# EAGLE design Board (EAGLE 9.5.2)

## Sheet 1 of 3
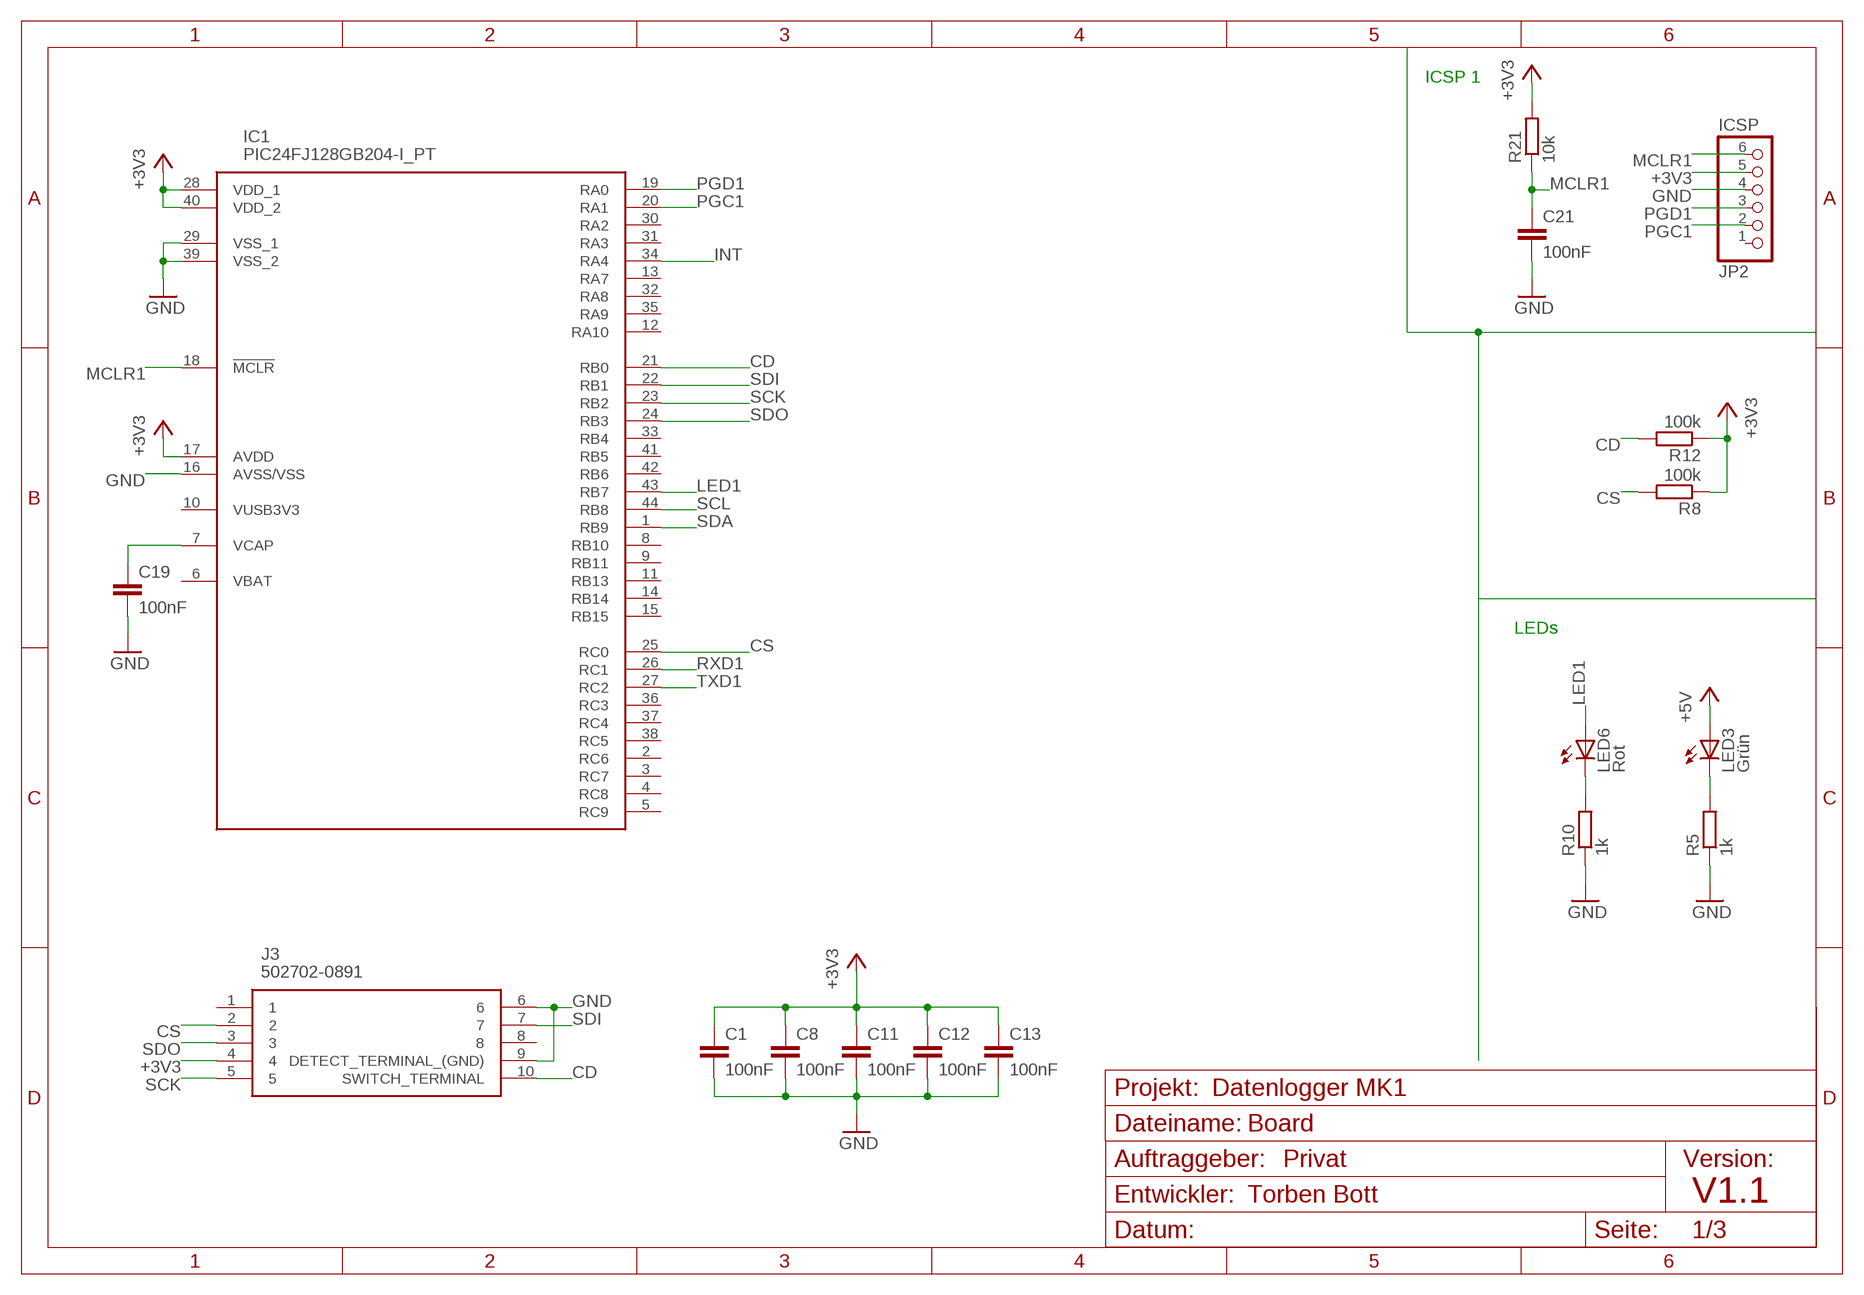
[diagram p0: schematic, sheet 1]

### Parts
C1  100nF  C-EUC0805  [C0805]
C8  100nF  C-EUC0805  [C0805]
C11  100nF  C-EUC0805  [C0805]
C12  100nF  C-EUC0805  [C0805]
C13  100nF  C-EUC0805  [C0805]
C19  100nF  C-EUC0805  [C0805]
C21  100nF  C-EUC0805  [C0805]
IC1  PIC24FJ128GB204-I_PT  [QFP80P1200X1200X120-44N]
J3  502702-0891  [502702-0891]
JP2  ICSP  PINHD-1X6/90  [1X06/90]
LED3  Grün  LEDCHIPLED_0805  [CHIPLED_0805]
LED6  Rot  LEDCHIPLED_0805  [CHIPLED_0805]
R5  1k  R-EU_R0805  [R0805]
R8  100k  R-EU_R0805  [R0805]
R10  1k  R-EU_R0805  [R0805]
R12  100k  R-EU_R0805  [R0805]
R21  10k  R-EU_R0805  [R0805]

### Nets
+3V3: C1.1 C8.1 C11.1 C12.1 C13.1 IC1.17(AVDD) IC1.28(VDD_1) IC1.40(VDD_2) J3.4 JP2.5 R8.1 R12.1 R21.2 ; also sheet 2,3
+5V: LED3.A ; also sheet 3
CD: IC1.21(RB0) J3.10(SWITCH_TERMINAL) R12.2
CS: IC1.25(RC0) J3.2 R8.2
GND: C1.2 C8.2 C11.2 C12.2 C13.2 C19.2 C21.2 IC1.16(AVSS/VSS) IC1.29(VSS_1) IC1.39(VSS_2) J3.6 J3.9(DETECT_TERMINAL_(GND)) JP2.4 R5.1 R10.1 ; also sheet 2,3
INT: IC1.34(RA4) ; also sheet 2
LED1: IC1.43(RB7) LED6.A
MCLR1: C21.1 IC1.18(!MCLR) JP2.6 R21.1
N$8: LED3.C R5.2
N$16: LED6.C R10.2
N$20: C19.1 IC1.7(VCAP)
PGC1: IC1.20(RA1) JP2.2
PGD1: IC1.19(RA0) JP2.3
RXD1: IC1.26(RC1)
SCK: IC1.23(RB2) J3.5
SCL: IC1.44(RB8) ; also sheet 2
SDA: IC1.1(RB9) ; also sheet 2
SDI: IC1.22(RB1) J3.7
SDO: IC1.24(RB3) J3.3
TXD1: IC1.27(RC2)
Unconnected: IC1.2(RC6) IC1.3(RC7) IC1.4(RC8) IC1.5(RC9) IC1.6(VBAT) IC1.8(RB10) IC1.9(RB11) IC1.10(VUSB3V3) IC1.11(RB13) IC1.12(RA10) IC1.13(RA7) IC1.14(RB14) IC1.15(RB15) IC1.30(RA2) IC1.31(RA3) IC1.32(RA8) IC1.33(RB4) IC1.35(RA9) IC1.36(RC3) IC1.37(RC4) IC1.38(RC5) IC1.41(RB5) IC1.42(RB6) J3.1 J3.8 JP2.1

### Notes on the sheet
- ICSP 1
- LEDs
- Datenlogger MK1
- Privat
- Torben Bott | V1.1

## Sheet 2 of 3
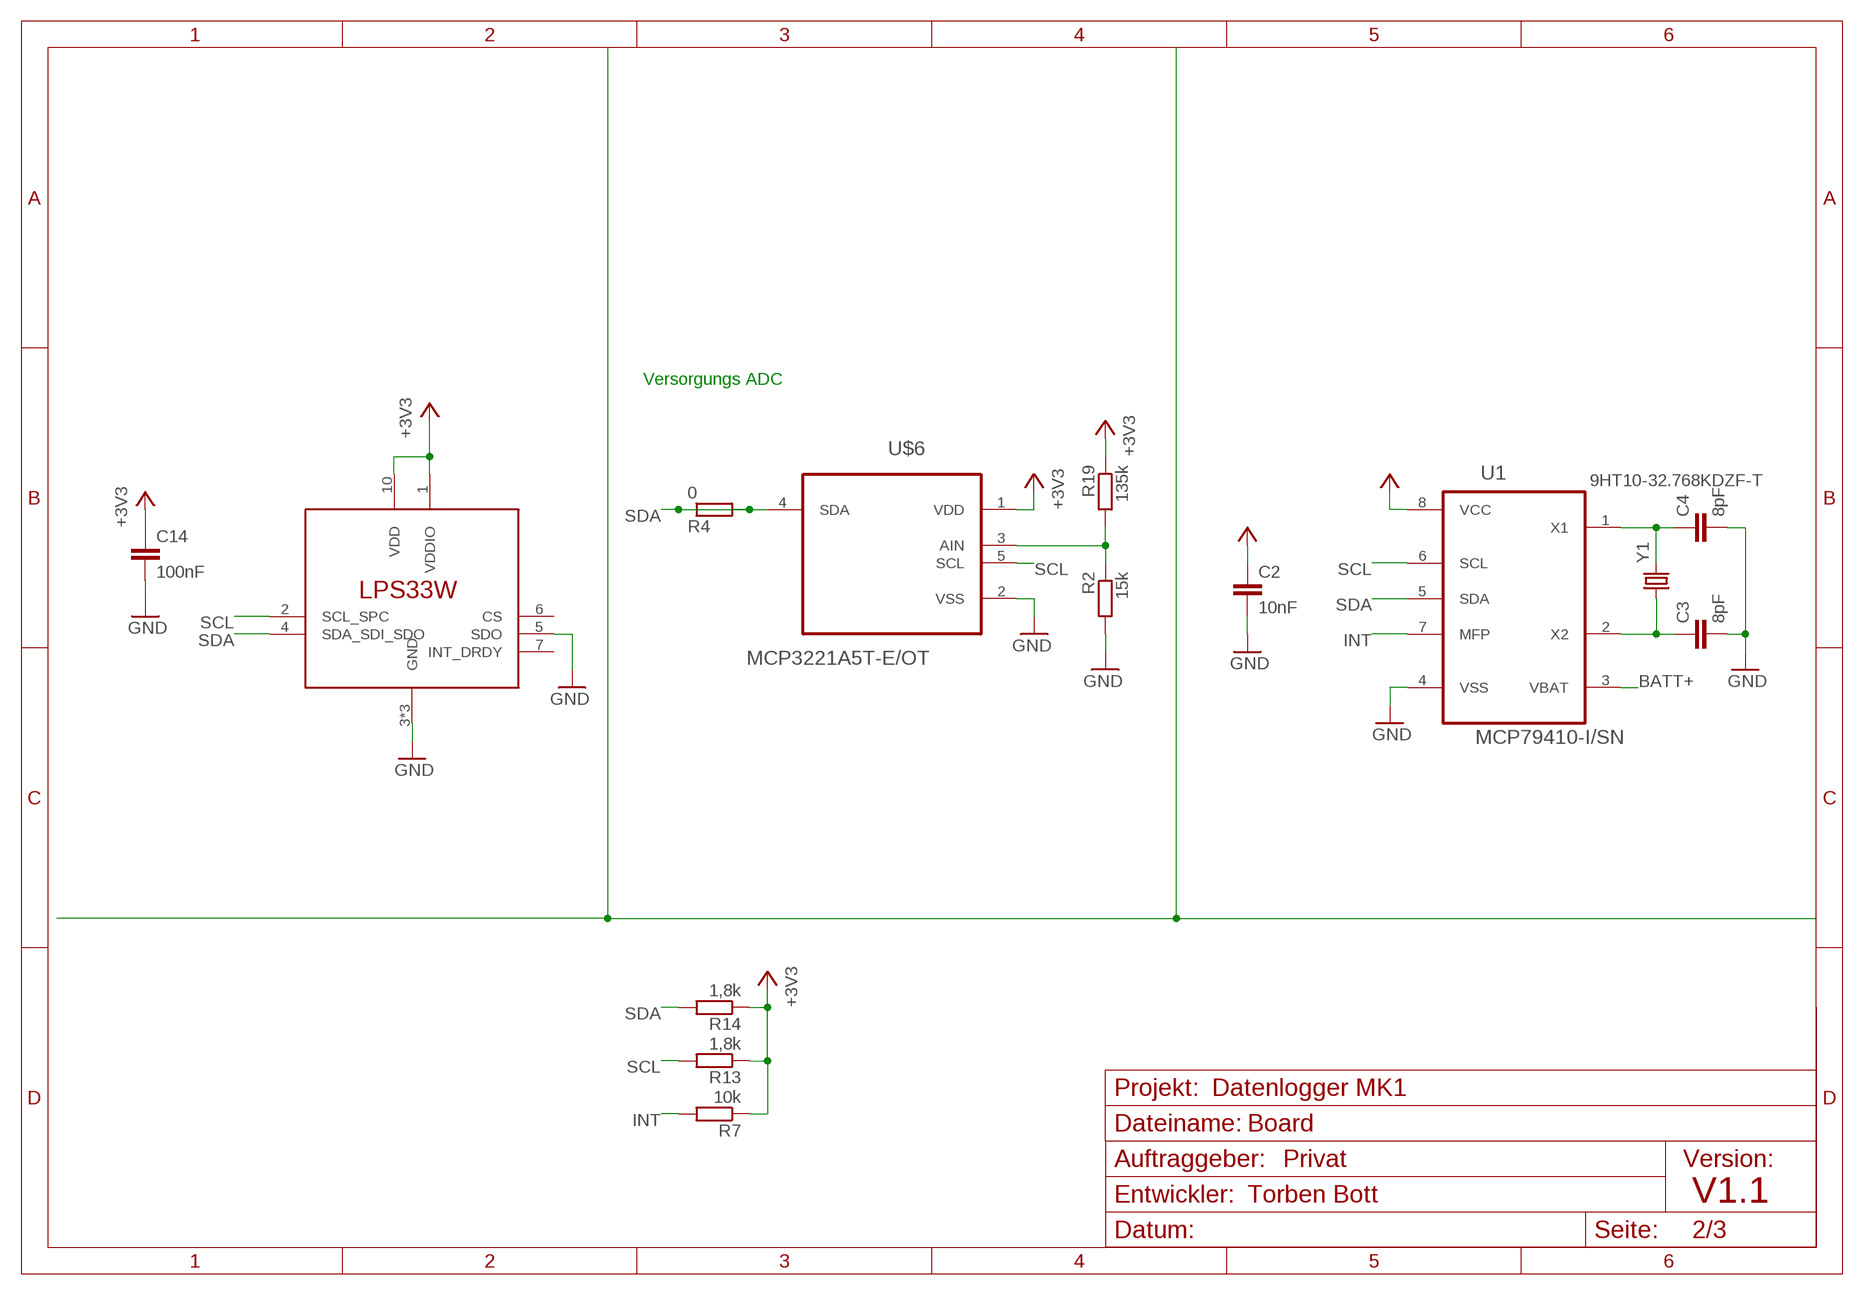
[diagram p1: schematic, sheet 2]

### Parts
C2  10nF  C-EUC0805  [C0805]
C3  8pF  C-EUC0805  [C0805]
C4  8pF  C-EUC0805  [C0805]
C14  100nF  C-EUC0805  [C0805]
R2  15k  R-EU_R0805  [R0805]
R4  0  R-EU_R0805  [R0805]
R7  10k  R-EU_R0805  [R0805]
R13  1,8k  R-EU_R0805  [R0805]
R14  1,8k  R-EU_R0805  [R0805]
R19  135k  R-EU_R0805  [R0805]
U1  MCP79410-I/SN  [SOIC127P600X175-8N]
U$6  MCP3221A5T-E/OT  [SOT95P270X145-5N]
U$7  LPS33W  [CCLGA10L]
Y1  9HT10-32.768KDZF-T  [9HT1032768KEZFT]

### Nets
+3V3: C2.1 C14.1 R7.1 R13.1 R14.1 R19.1 U1.8(VCC) U$6.1(VDD) U$7.1(VDDIO) U$7.10(VDD) ; also sheet 1,3
BATT+: U1.3(VBAT) ; also sheet 3
GND: C2.2 C3.2 C4.2 C14.2 R2.2 U1.4(VSS) U$6.2(VSS) U$7.3(GND) U$7.5(SDO) U$7.8(GND) U$7.9(GND) ; also sheet 1,3
INT: R7.2 U1.7(MFP) ; also sheet 1
N$11: C3.1 U1.2(X2) Y1.1
N$13: C4.1 U1.1(X1) Y1.2
N$21: R2.1 R19.2 U$6.3(AIN)
SCL: R13.2 U1.6(SCL) U$6.5(SCL) U$7.2(SCL_SPC) ; also sheet 1
SDA: R4.1 R4.2 R14.2 U1.5(SDA) U$6.4(SDA) U$7.4(SDA_SDI_SDO) ; also sheet 1
Unconnected: U$7.6(CS) U$7.7(INT_DRDY)

### Notes on the sheet
- Versorgungs ADC
- Datenlogger MK1
- Privat
- Torben Bott | V1.1

## Sheet 3 of 3
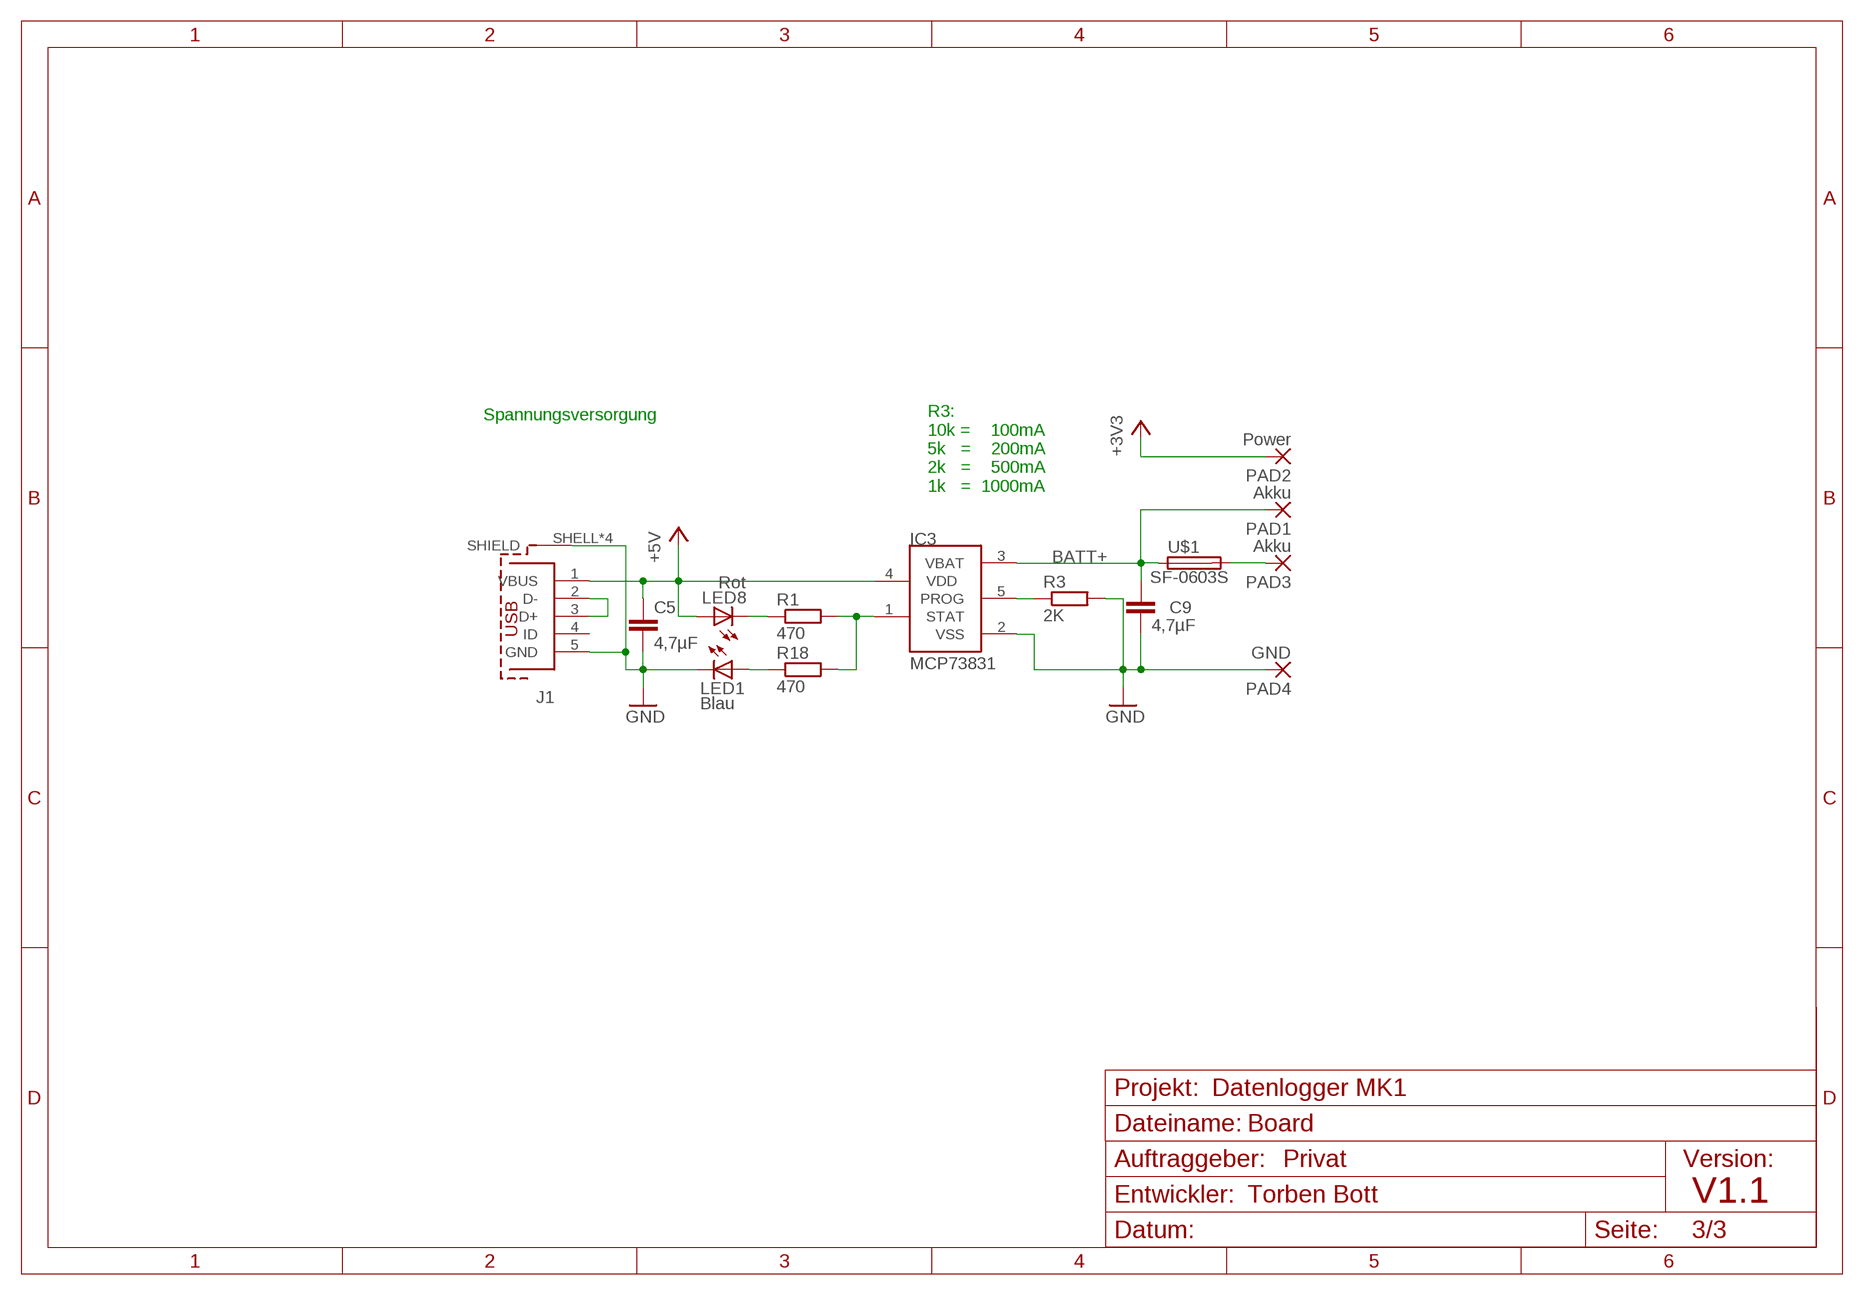
[diagram p2: schematic, sheet 3]

### Parts
C5  4,7µF  C-EUC0805  [C0805]
C9  4,7µF  C-EUC0805  [C0805]
IC3  MCP73831  [SOT23-5L]
J1  629105136821  [629105136821]
LED1  Blau  LEDCHIPLED_0805  [CHIPLED_0805]
LED8  Rot  LEDCHIPLED_0805  [CHIPLED_0805]
PAD1  Akku  WIREPADSMD5-1,8  [5-1,8]
PAD2  Power  WIREPADSMD5-1,8  [5-1,8]
PAD3  Akku  WIREPADSMD5-1,8  [5-1,8]
PAD4  GND  WIREPADSMD5-1,8  [5-1,8]
R1  470  R-EU_R0805  [R0805]
R3  2K  R-EU_R0805  [R0805]
R18  470  R-EU_R0805  [R0805]
U$1  SF-0603S  [R0603]

### Nets
+3V3: PAD2.1(P) ; also sheet 1,2
+5V: C5.1 IC3.4(VDD) J1.1(VBUS) LED8.A ; also sheet 1
BATT+: C9.1 IC3.3(VBAT) PAD1.1(P) U$1.1 ; also sheet 2
GND: C5.2 C9.2 IC3.2(VSS) J1.5(GND) J1.SHELL1(SHIELD) J1.SHELL2(SHIELD) J1.SHELL3(SHIELD) J1.SHELL(SHIELD) LED1.C PAD4.1(P) R3.2 ; also sheet 1,2
N$3: LED8.C R1.1
N$5: IC3.5(PROG) R3.1
N$6: PAD3.1(P) U$1.2
N$7: LED1.A R18.1
N$23: IC3.1(STAT) R1.2 R18.2
N$27: J1.2(D-) J1.3(D+)
Unconnected: J1.4(ID)

### Notes on the sheet
- Spannungsversorgung
- R3:
  10k =    100mA
  5k   =    200mA
  2k   =    500mA
  1k   =  1000mA
- Datenlogger MK1
- Privat
- Torben Bott | V1.1

## Library data of the parts
C1-C4 C8 C11-C14 C19 C21 = rcl:C-EU: CAPACITOR, European symbol; SPICEPREFIX: C
C5 C9 = rcl:C-EU: CAPACITOR, European symbol
IC1 = PIC24FJ128GB204-I_PT:PIC24FJ128GB204-I_PT: PIC24FJ128GB204-I/PT 16bit PIC Microcontroller, 32MHz, 128 kB Flash, 8 kB RAM, 44-Pin TQFP Source: Datasheet <https://componentsearchengine.com/Datasheets/1/PIC24FJ128GB204-I_PT.pdf>; DESCRIPTION: PIC24FJ128GB204-I/PT 16bit PIC Microcontroller, 32MHz, 128 kB Flash, 8 kB RAM, 44-Pin TQFP; HEIGHT: 1.2mm; MANUFACTURER_NAME: Microchip; MANUFACTURER_PART_NUMBER: PIC24FJ128GB204-I/PT; MOUSER_PART_NUMBER: 579-P24FJ128GB204IPT; MOUSER_PRICE-STOCK: https://www.mouser.com/Search/Refine.aspx?Keyword=579-P24FJ128GB204IPT
IC3 = microchip-update-2:MCP73831: Miniature Single-Cell, Fully Integrated Li-Ion, Li-Polymer Charge Management Controllers
J1 = InputOutputIO (rev18a):629105136821: WR-COM SMT Horizontal 5 Contacts Micro USB Type B,5 pins=>Code : Con_I-O_COM_MicroUSB_629105136821 <http://katalog.we-online.de/media/images/eican/Con_I-O_COM_MicroUSB_629105136821_pf2.jpg> Details see: http://katalog.we-online.de/en/em/COM_MICRO_SMT_TYPE_B_HORIZONTAL/629105136821?m Created 2014-07-09, Karrer Zheng 2014 (C) Würth Elektronik
J3 = 502702-0891:502702-0891: MOLEX - 502702-0891 - MEMORY CARD CONNECTOR, MICROSD, 8 POSITION Source: Datasheet <https://componentsearchengine.com/Datasheets/1/502702-0891.pdf>; DESCRIPTION: MOLEX - 502702-0891 - MEMORY CARD CONNECTOR, MICROSD, 8 POSITION; HEIGHT: mm; MANUFACTURER_NAME: Molex; MANUFACTURER_PART_NUMBER: 502702-0891; MOUSER_PART_NUMBER: 538-502702-0891; MOUSER_PRICE-STOCK: https://www.mouser.com/Search/Refine.aspx?Keyword=538-502702-0891
JP2 = pinhead:PINHD-1X6: PIN HEADER
LED1 LED3 LED6 LED8 = led:LED: LED OSRAM: - CHIPLED LG R971, LG N971, LY N971, LG Q971, LY Q971, LO R971, LY R971 LH N974, LH R974 LS Q976, LO Q976, LY Q976 LO Q996 - Hyper CHIPLED LW Q18S LB Q993, LB Q99A, LB R99A - SideLED LS A670, LO A670, LY A670, LG A670, LP A670 LB A673, LV A673, LT A673, LW A673 LH A674 LY A675 LS A676, LA A676, LO A676, LY A676, LW A676 LS A679, LY A679, LG A679 - Hyper Micro SIDELED® LS Y876, LA Y876, LO Y876, LY Y876 LT Y87S - SmartLED LW L88C, LW L88S LB L89C, LB L89S, LG L890 LS L89K, LO L89K, LY L89K LS L896, LA L896, LO L896, LY L896 - TOPLED LS T670, LO T670, LY T670, LG T670, LP T670 LSG T670, LSP T670, LSY T670, LOP T670, LYG T670 LG T671, LOG T671, LSG T671 LB T673, LV T673, LT T673, LW T673 LH T674 LS T676, LA T676, LO T676, LY T676, LB T676, LH T676, LSB T676, LW T676 LB T67C, LV T67C, LT T67C, LS T67K, LO T67K, LY T67K, LW E67C LS E67B, LA E67B, LO E67B, LY E67B, LB E67C, LV E67C, LT E67C LW T67C LS T679, LY T679, LG T679 LS T770, LO T770, LY T770, LG T770, LP T770 LB T773, LV T773, LT T773, LW T773 LH T774 LS E675, LA E675, LY E675, LS T675 LS T776, LA T776, LO T776, LY T776, LB T776 LHGB T686 LT T68C, LB T68C - Hyper Mini TOPLED® LB M676 - Mini TOPLED Santana® LG M470 LS M47K, LO M47K, LY M47K Source: http://www.osram.convergy.de LUXEON: - LUMILED® LXK2-PW12-R00, LXK2-PW12-S00, LXK2-PW14-U00, LXK2-PW14-V00 LXK2-PM12-R00, LXK2-PM12-S00, LXK2-PM14-U00 LXK2-PE12-Q00, LXK2-PE12-R00, LXK2-PE12-S00, LXK2-PE14-T00, LXK2-PE14-U00 LXK2-PB12-K00, LXK2-PB12-L00, LXK2-PB12-M00, LXK2-PB14-N00, LXK2-PB14-P00, LXK2-PB14-Q00 LXK2-PR12-L00, LXK2-PR12-M00, LXK2-PR14-Q00, LXK2-PR14-R00 LXK2-PD12-Q00, LXK2-PD12-R00, LXK2-PD12-S00 LXK2-PH12-R00, LXK2-PH12-S00 LXK2-PL12-P00, LXK2-PL12-Q00, LXK2-PL12-R00 Source: www.luxeon.com KINGBRIGHT: KA-3528ASYC Source: www.kingbright.com
PAD1-PAD4 = wirepad:WIREPAD: Wire PAD connect wire on PCB
R1 R3 R18 = rcl:R-EU_: RESISTOR, European symbol
R2 R4 R5 R7 R8 R10 R12-R14 R19 R21 = rcl:R-EU_: RESISTOR, European symbol; SPICEPREFIX: R
U1 = Microchip-MCP79410-I_SN:MCP79410-I/SN: I2C™ Real-Time Clock/Calendar with EEPROM, SRAM,SOIC-8; MPN: MCP79410-I/SN; OC_FARNELL: 1823155; OC_NEWARK: 76R6660; PACKAGE: SOIC-8; SUPPLIER: MICROCHIP
U$1 = Eigene Library:SF-0603S; FARNELL: 1652144
U$6 = Eigene Library:MCP3221A5T-E/OT: A/D Converter; MPN: MCP3221A5T-E/OT; OC_FARNELL: 1332098; OC_NEWARK: 34M7446; PACKAGE: SOT-5; SUPPLIER: Microchip
U$7 = microbuilder:LPS33W
Y1 = 9HT10-32.768KDZF-T:9HT10-32.768KDZF-T: TXC 32.768kHz Crystal +/-20ppm SMD 2-Pin 3.2 x 1.5 x 0.75mm Source: Datasheet <https://componentsearchengine.com/Datasheets/1/9HT10-32.768KDZF-T.pdf>; DESCRIPTION: TXC 32.768kHz Crystal +/-20ppm SMD 2-Pin 3.2 x 1.5 x 0.75mm; HEIGHT: 0.85mm; MANUFACTURER_NAME: TXC; MANUFACTURER_PART_NUMBER: 9HT10-32.768KDZF-T; MOUSER_PART_NUMBER: 717-9HT10-32.768KDZF; MOUSER_PRICE-STOCK: https://www.mouser.com/Search/Refine.aspx?Keyword=717-9HT10-32.768KDZF

## Board
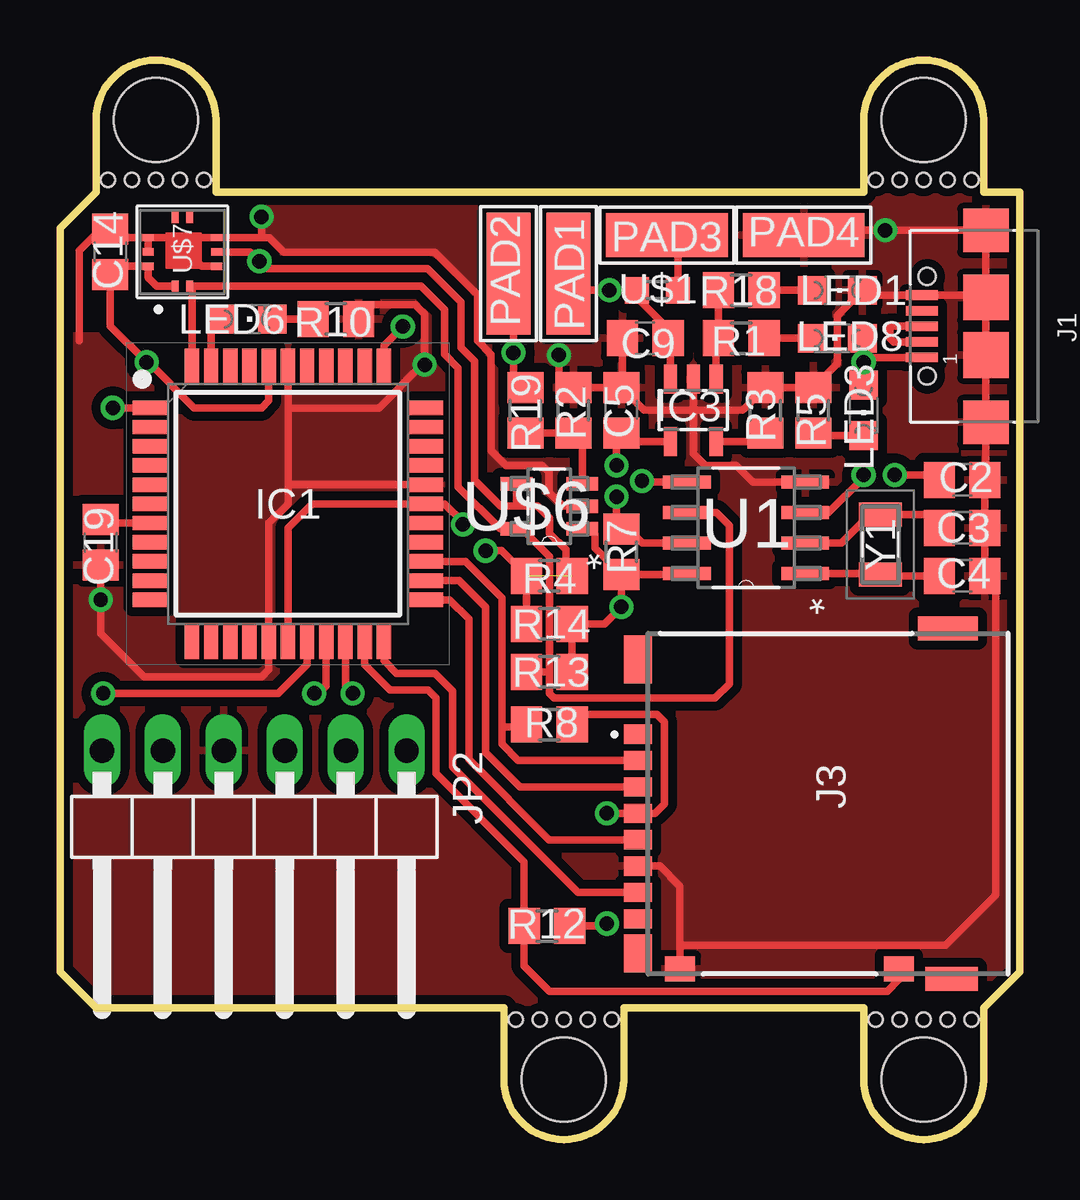
[diagram p3: board, top side]
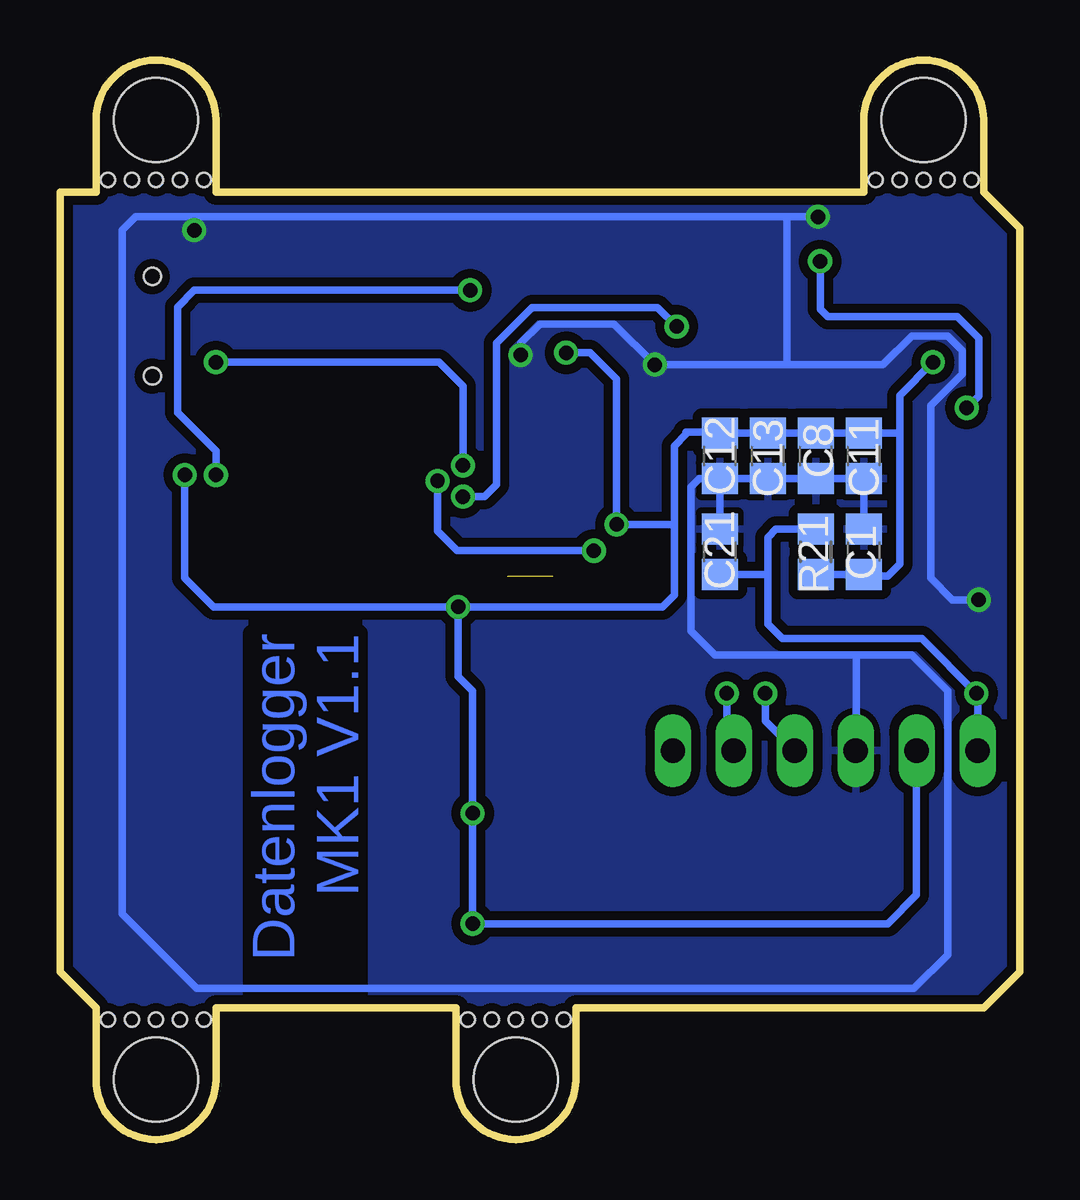
[diagram p4: board, bottom side, seen from below]

Size 40 x 45 mm. Coordinates in mm from the lower left corner, seen from the top.
Outline: 40,7 40,39.5 38.5,39.5 38.5,42.5 arc90 36,45 arc90 33.5,42.5 33.5,39.5 6.5,39.5 6.5,42.5 arc90 4,45 arc90 1.5,42.5 1.5,39.5 0,38 0,7 1.5,5.5 18.5,5.5 18.5,2.5 arc90 21,0 arc90 23.5,2.5 23.5,5.5 33.5,5.5 33.5,2.5 arc90 36,0 arc90 38.5,2.5 38.5,5.5 40,7
Copper layers (1*16): Top 0.035mm / dielectric 1.5mm / Bottom 0.035mm
Design rules "Torben": minimum track width 12mil, minimum drill 0.6mm, track to track 15mil, track to pad 8mil, pad to pad 6mil, via to via 6mil, smd to smd 6mil, copper to edge 15mil, drill to drill 6mil, minimum pad ring 10mil, minimum via ring 8mil, stop-mask expansion 4mil, vias tented up to drill 0mil, thermal gap 10mil
Holes 3.5 mm at 36,2.5 36,42.5 4,42.5 21,2.5
Holes 0.6 mm at 38,5 37,5 36,5 35,5 34,5 34,40 35,40 36,40 37,40 38,40 2,40 3,40 4,40 5,40 6,40 23,5 22,5 21,5 20,5 19,5

### Footprints (pad centres in the part's own frame; a part is rotated, then mirrored left to right if it is on the bottom)
C0805 = smd 1.3 x 1.5: 1 -0.95,0; 2 0.95,0
QFP80P1200X1200X120-44N = smd 1.475 x 0.6: 1 -5.738,4; 2 -5.738,3.2; 3 -5.738,2.4; 4 -5.738,1.6; 5 -5.738,0.8; 6 -5.738,0; 7 -5.738,-0.8; 8 -5.738,-1.6; 9 -5.738,-2.4; 10 -5.738,-3.2; 11 -5.738,-4; 23 5.738,-4; 24 5.738,-3.2; 25 5.738,-2.4; 26 5.738,-1.6; 27 5.738,-0.8; 28 5.738,0; 29 5.738,0.8; 30 5.738,1.6; 31 5.738,2.4; 32 5.738,3.2; 33 5.738,4 | smd 0.6 x 1.475: 12 -4,-5.738; 13 -3.2,-5.738; 14 -2.4,-5.738; 15 -1.6,-5.738; 16 -0.8,-5.738; 17 0,-5.738; 18 0.8,-5.738; 19 1.6,-5.738; 20 2.4,-5.738; 21 3.2,-5.738; 22 4,-5.738; 34 4,5.738; 35 3.2,5.738; 36 2.4,5.738; 37 1.6,5.738; 38 0.8,5.738; 39 0,5.738; 40 -0.8,5.738; 41 -1.6,5.738; 42 -2.4,5.738; 43 -3.2,5.738; 44 -4,5.738
SOT23-5L = smd 0.55 x 1.2: 1 -0.95,-1.3; 2 0,-1.3; 3 0.95,-1.3; 4 0.95,1.3; 5 -0.95,1.3
629105136821 = smd 0.4 x 1.35: 1 -1.3,2.675; 2 -0.65,2.675; 3 0,2.675; 4 0.65,2.675; 5 1.3,2.675 | smd 1.8 x 1.9: SHELL -4,0; SHELL3 4,0 | smd 1.9 x 1.9: SHELL1 -1.2,0; SHELL2 1.2,0 | hole 0.7: -2.075,2.45; 2.075,2.45
502702-0891 = smd 0.8 x 1.16: 1 4.9,0; 2 6,0; 3 7.1,0; 4 8.2,0; 5 9.3,0; 6 10.4,0; 7 11.5,0; 8 12.6,0 | smd 1.05 x 1.25: 9 14.685,1.745; 10 14.685,10.87 | smd 1 x 2.2: 11 15.1,13.07 | smd 1 x 2.5: 12 0.5,12.92 | smd 2 x 1.16: 13 1.79,0 | smd 1.6 x 1.16: 14 14.04,0
1X06/90 = drill 1.016 long: 1 -6.35,-3.81; 2 -3.81,-3.81; 3 -1.27,-3.81; 4 1.27,-3.81; 5 3.81,-3.81; 6 6.35,-3.81
CHIPLED_0805 = smd 1.2 x 1.2: A 0,-1.05; C 0,1.05
5-1,8 = smd 1.829 x 5.08: 1 0,0
R0805 = smd 1.3 x 1.5: 1 -0.95,0; 2 0.95,0
SOIC127P600X175-8N = smd 1.981 x 0.559: 1 -2.464,1.905; 2 -2.464,0.635; 3 -2.464,-0.635; 4 -2.464,-1.905; 5 2.464,-1.905; 6 2.464,-0.635; 7 2.464,0.635; 8 2.464,1.905
R0603 = smd 1 x 1.1: 1 -0.85,0; 2 0.85,0
SOT95P270X145-5N = smd 1.321 x 0.559: 1 -1.372,0.94; 2 -1.372,0; 3 -1.372,-0.94; 4 1.372,-0.94; 5 1.372,0.94
CCLGA10L = smd 0.45 x 0.3: 1 -1.425,0.3; 2 -1.425,-0.3; 6 1.425,-0.3; 7 1.425,0.3 | smd 0.3 x 0.45: 3 -0.6,-1.425; 4 0,-1.425; 5 0.6,-1.425; 8 0.6,1.425; 9 0,1.425; 10 -0.6,1.425
9HT1032768KEZFT = smd 1 x 1.8: 1 -1.25,0; 2 1.25,0

### Placement (x,y rotation side)
C1  6.5,24.5 90 bottom
C2  37.6,27.5 0 top
C3  37.6,25.5 0 top
C4  37.6,23.5 0 top
C5  23.4,30.4 90 top
C8  8.5,28.5 270 bottom
C9  24.4,33.4 180 top
C11  6.5,28.5 270 bottom
C12  12.5,28.5 270 bottom
C13  10.5,28.5 270 bottom
C14  2.1,37 90 top
C19  1.7,24.9 270 top
C21  12.5,24.5 90 bottom
IC1  9.5,26.5 0 top
IC3  26.4,30.4 180 top
J1  38.6,33.9 90 top
J3  24.1,21.8 270 top
JP2  8.1,12.4 180 top
LED1  32.4,35.4 270 top
LED3  33.5,30.4 180 top
LED6  7.8,34.2 270 top
LED8  32.4,33.4 90 top
PAD1  21.2,36.1 180 top
PAD2  18.7,36.1 0 top
PAD3  25.3,37.7 90 top
PAD4  31,37.7 90 top
R1  28.4,33.4 180 top
R2  21.4,30.4 90 top
R3  29.4,30.4 90 top
R4  20.4,23.5 0 top
R5  31.4,30.4 270 top
R7  23.4,24.5 90 top
R8  20.4,17.3 180 top
R10  11.5,34.2 180 top
R12  20.3,8.9 180 top
R13  20.4,19.5 180 top
R14  20.4,21.5 180 top
R18  28.4,35.4 180 top
R19  19.4,30.4 270 top
R21  8.5,24.5 270 bottom
U1  28.6,25.5 180 top
U$1  24.9,35.4 0 top
U$6  20.4,26.4 180 top
U$7  5.1,37 90 top
Y1  34.2,24.8 270 top

### Tracks (layer width: path | path; a pad name or v marks a point on that pad's centre or on a via)
+3V3  (via drill 0.6)
  Top 0.305: IC1.17 9.5,25.5 10.5,26.5 IC1.28 16.04,26.5 16.8,25.74 v16.8,25.64 | v22.8,13.6 J3.4 24.8,13.6 25.2,14 25.2,17.4 24.89,17.71 21.76,17.71 R8.1 | v22.8,9 22.7,8.9 R12.1 | C2.1 36.45,27.7 v34.8,27.7 | R7.1 26.09,23.55 U1.8 | U$6.1 22.07,25.46 22.29,25.24 22.29,24.65 22.5,24.44 22.51,24.44 R7.1 | R7.1 v23.4,22.2 22.7,21.5 R14.1 R13.1 | PAD2.1 18.9,35.9 v18.9,32.8 18.9,31.95 19.4,31.45 R19.1 | U$7.1 4.02,35.58 3.67,35.92 U$7.10 2.45,36.4 C14.1 2.1,33.91 v3.61,32.4 3.65,32.44 5.59,30.5 8.4,30.5 8.7,30.8 IC1.40
  Bottom 0.305: R21.2 C1.1 6.45,23.5 5.5,23.5 5,24 5,29.5 | C8.1 C11.1 5.05,29.45 5,29.5 | C8.1 C13.1 C12.1 12.55,29.5 13.9,29.5 13.9,29.4 14.39,28.91 14.39,25.7 | v3.6,32.41 v3.61,32.4 5,31.01 5,29.5 | 8.81,29.76 C8.1 | 14.39,25.7 14.39,22.7 14.89,22.2 v23.4,22.2 | v23.4,22.2 33.6,22.2 34.8,23.4 v34.8,27.7 | JP2.5 4.3,10.2 5.5,9 v22.8,9 v22.8,13.6 22.8,18.7 23.4,19.3 v23.4,22.2 | 14.39,25.7 14.45,25.64 v16.8,25.64 16.8,31.7 17.9,32.8 v18.9,32.8
+5V  (via drill 0.6)
  Top 0.305: IC3.4 23.75,29.1 C5.1 | C5.1 23.3,29.35 | LED8.A 33.5,33.35 33.5,32.7 | 33.5,32.7 v33.5,32.4 LED3.A | J1.1 33.6,32.6 33.5,32.7 | C5.1 23.2,29.25 v23.2,28.1
  Bottom 0.305: v23.2,28.1 23.2,31.4 24.2,32.4 v33.5,32.4
BATT+  (via drill 0.6)
  Top 0.305: IC3.3 25.45,33.3 C9.1 25.35,33.8 24.05,35.1 U$1.1 v22.9,35.4 21.9,35.4 PAD1.1 | U1.3 32.03,26.13 33.5,27.6 v33.5,27.7
  Bottom 0.305: v22.9,35.4 34.4,35.4 35.1,34.7 35.1,30.3 33.5,28.7 v33.5,27.7
CD
  Top 0.305: IC1.21 12.7,19.8 13.75,18.75 15.34,18.75 15.68,18.42 15.68,15.25 19.35,11.58 R12.2 19.35,7.25 20.41,6.19 34.49,6.19 34.97,6.67 J3.10
CS
  Top 0.305: IC1.25 16.9,24.1 18.42,22.58 18.42,17.2 | J3.2 19.1,15.8 18.42,16.48 18.42,17.2 | R8.2 19.35,17.2 18.42,17.2
GND  (via drill 0.6)
  Top 0.305: IC1.39 9.5,30.5 | 9.5,30.5 9.5,27.3 | 9.5,27.3 9.5,26.5 8.7,25.7 IC1.16 8.7,19.59 8.4,19.29 3.51,19.29 1.7,21.1 v1.7,22.5 C19.2 | J3.9 25.84,8.1 | 25.84,8.1 25.84,10.55 25,11.4 J3.6 | C5.2 23.4,31.4 23.35,31.35 R2.2 20.8,31.95 v20.8,32.7 | R3.2 28.51,30.46 28.5,30.46 28.45,30.4 26.4,30.4 | C5.2 24.29,30.46 24.3,30.46 24.35,30.4 26.4,30.4 | IC3.2 26.4,30.4 | 38.5,35.2 J1.5 33.65,35.2 LED1.C 32.4,34.35 32.4,32.35 R5.1 R3.2 | 38.5,35.2 J1.SHELL2 J1.SHELL1 J1.SHELL 38.6,27.55 C2.2 C3.2 C4.2 39,23.05 39,10.2 36.9,8.1 25.84,8.1 | 38.5,35.2 38.6,35.3 J1.SHELL3 v34.4,37.9 31.2,37.9 PAD4.1 | 29.5,31.35 R3.2 | U1.4 28.9,27.41 28.2,28.1 26.9,28.1 26.4,28.6 26.4,30.4 | U$7.9 U$7.8 | U$7.8 5.3,37.6 | 5.3,37.6 U$7.5 8.4,37.6 | U$7.3 5.9,36.4 5.3,37 5.3,37.6 | U$7.8 2.45,37.6 C14.2 1.7,37.95 0.8,37.05 0.8,33.3 | 9.5,30.5 13.3,30.5 15.1,32.3 v15.2,32.3 15.2,34.4 14.8,34.8 13.05,34.8 R10.1 | U$6.2 20.97,26.4 20.39,26.98 20.39,27.81 20.1,28.1 18.6,28.1 17.97,28.73 17.97,32.73 17.4,33.3 17.4,35.21 15.61,37 9.33,37 8.73,37.6 8.4,37.6 | 8.4,37.6 v8.4,38.46 | IC1.29 9.5,27.3 | C9.2 23.45,31.4 C5.2
  Bottom 0.305: C1.2 C11.2 C8.2 C13.2 C12.2 | C12.2 C21.2 13.05,25.45 | v15.2,32.3 15.19,32.29 | C12.2 13.35,27.55 13.7,27.2 13.7,21.2 12.7,20.2 6.8,20.2 | v15.2,32.3 16.9,34 20,34 20.8,33.2 v20.8,32.7 | v8.4,38.46 9.7,38.46 | 9.7,38.46 34.5,38.46 | 34.5,38.46 36.84,38.46 37.4,37.9 37.4,9.4 34.3,6.3 4.4,6.3 3,7.7 3,18.7 4.49,20.2 6.8,20.2 | v34.4,37.9 34.4,38.36 34.5,38.46 | v15.2,32.3 9.7,32.3 | 9.7,32.3 5.7,32.3 4.5,33.5 3,33.5 2.39,32.89 2.39,31.91 3.7,30.6 3.7,23.4 2.8,22.5 v1.7,22.5 | 9.7,38.46 9.7,32.3 | JP2.4 6.8,16.24 6.8,20.2
  pour Bottom: 1.5,39.5 0,38 0,7 1.5,5.5 38.5,5.5 40,7 40,39.5
  pour Top: 40,39.5 40,7 38.5,5.5 1.5,5.5 0,7 0,33 0.5,33.5 8,33.5 8.5,34 8.5,39 9,39.5
INT  (via drill 0.6)
  Top 0.305: U1.7 24.28,24.87 23.7,25.45 R7.2 23.2,25.65 v23.2,26.8 | IC1.34 13.5,33.1 v14.29,33.89
  Bottom 0.305: v14.29,33.89 15.09,34.69 20.31,34.69 21.8,33.2 21.8,27.3 22.3,26.8 v23.2,26.8
LED1
  Top 0.305: IC1.43 6.3,33.75 LED6.A
MCLR1  (via drill 0.6)
  Top 0.305: IC1.18 10.3,19.8 9.1,18.6 v1.8,18.6
  Bottom 0.305: 12.4,23.55 C21.1 10.55,23.55 10.5,23.6 | R21.1 10.15,25.45 10.5,25.1 10.5,23.6 | JP2.6 1.75,18.55 v1.8,18.6 4.08,20.88 9.88,20.88 10.5,21.5 10.5,23.6
N$3
  Top 0.305: LED8.C R1.1
N$5
  Top 0.305: IC3.5 29.05,29.1 R3.1
N$6
  Top 0.305: 24.1,37.7 PAD3.1 25.75,37.25 U$1.2
N$7
  Top 0.305: LED1.A R18.1
N$8
  Top 0.305: LED3.C 31.5,29.35 R5.2
N$11
  Top 0.305: C3.1 36.1,26.05 Y1.1 33.75,26.05 32.56,24.87 U1.2
N$13
  Top 0.305: C4.1 34.25,23.5 Y1.2 34.16,23.59 U1.1
N$16
  Top 0.305: LED6.C R10.2
N$20
  Top 0.305: IC1.7 2.15,25.7 C19.1
N$21
  Top 0.305: R19.2 R2.1 21.77,29.08 U$6.3
N$23
  Top 0.305: R18.2 R1.2 27.35,33.3 IC3.1
N$27
  Top 0.305: J1.2 34.75,33.25 34.6,33.4 34.6,33.9 J1.3
PGC1  (via drill 0.6)
  Top 0.305: IC1.20 11.9,18.9 v12.2,18.6
  Bottom 0.305: v12.2,18.6 12.2,16.5 JP2.2
PGD1  (via drill 0.6)
  Top 0.305: IC1.19 11.1,18.9 10.8,18.6 v10.6,18.6
  Bottom 0.305: v10.6,18.6 10.6,17.44 JP2.3
SCK
  Top 0.305: J3.5 20.39,12.5 17.05,15.84 17.05,21.7 16.25,22.5 IC1.23 15.85,22.5
SCL
  Top 0.305: U1.6 27.37,26.13 27.9,25.6 27.9,19 27.3,18.4 20.6,18.4 20.4,18.6 20.4,19.5 | 20.4,19.5 20.4,24.3 19.24,25.46 U$6.5 18.34,25.46 16.6,27.2 16.6,32.16 16.03,32.73 16.03,34.6 15.05,35.58 5.5,35.58 | 20.4,19.5 R13.2 | U$7.2 5.5,35.58 | IC1.44 5.5,35.58
SDA  (via drill 0.6)  (1 unrouted)
  Top 0.305: 19.3,21.5 R14.2 R4.1 18.41,24.54 v17.74,24.54 | R4.2 21.09,23.76 21.09,24.58 20.4,25.27 20.4,25.9 19.9,26.4 19,26.4 | U1.5 24.31,27.41 v24.26,27.45 | U$7.4 7.92,37 v8.31,36.61 8.62,36.3 15.33,36.3 16.71,34.91 16.71,33.02 17.29,32.44 17.29,27.48 18.37,26.4 19,26.4 | IC1.1 v2.2,30.5 | U$6.4 19.03,26.43 19,26.4
  Bottom 0.305: v2.2,30.5 1.7,31 1.7,33.4 2.6,34.3 8,34.3 8.31,34.61 v8.31,36.61 | v17.74,24.54 23.44,24.54 24.26,25.36 v24.26,27.45
SDI
  Top 0.305: IC1.22 13.5,19.97 14.03,19.44 15.63,19.44 16.36,18.7 16.36,15.54 21.6,10.3 J3.7
SDO
  Top 0.305: IC1.24 16.63,23.3 17.73,22.2 17.73,16.14 19.17,14.7 J3.3
(copper drawn outside any net)
  shapes: Top area x1

### Text on the board
Bottom: Datenlogger / MK1 V1.1